# EAGLE design MCP3208BOB (EAGLE 9.6.2)
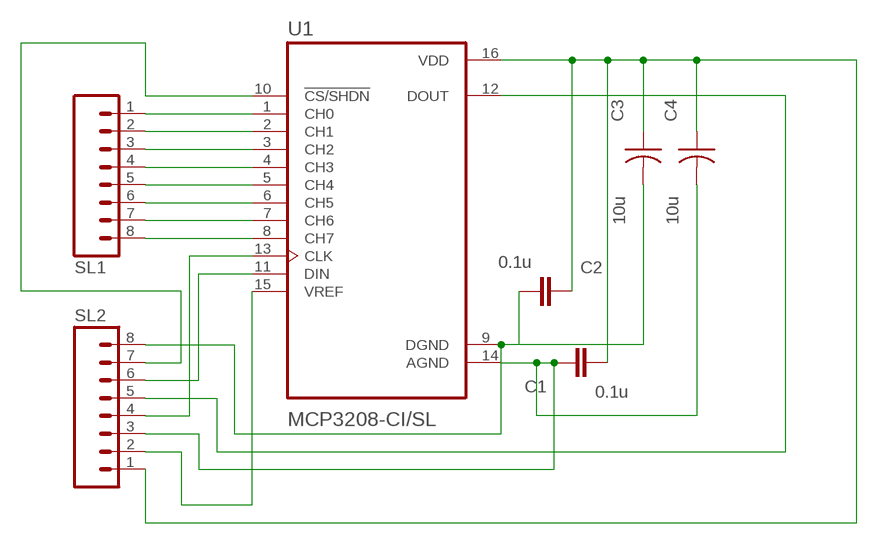
[diagram p0: schematic, sheet 1]

## Parts
C1  0.1u  CC0805KRX7R9BB104  [CAP_0805]
C2  0.1u  CC0805KRX7R9BB104  [CAP_0805]
C3  10u  TAJB106K016RNJ  [CAP_TANT_B]
C4  10u  TAJB106K016RNJ  [CAP_TANT_B]
SL1  M08  [08P]
SL2  M08  [08P]
U1  MCP3208-CI/SL  [SOIC127P600X175-16N]

## Nets
N$1: C1.2 C2.1 C3.1 C4.1 SL2.1 U1.16(VDD)
N$3: SL2.6 U1.11(DIN)
N$4: C1.1 C4.2 SL2.3 U1.14(AGND)
N$5: SL1.1 U1.1(CH0)
N$6: SL1.2 U1.2(CH1)
N$7: SL1.3 U1.3(CH2)
N$8: SL1.4 U1.4(CH3)
N$9: SL1.5 U1.5(CH4)
N$10: SL1.7 U1.7(CH6)
N$11: SL1.6 U1.6(CH5)
N$12: SL1.8 U1.8(CH7)
N$13: C2.2 C3.2 SL2.8 U1.9(DGND)
N$14: SL2.5 U1.12(DOUT)
N$15: SL2.7 U1.10(!CS/SHDN)
N$16: SL2.4 U1.13(CLK)
N$18: SL2.2 U1.15(VREF)

## Library data of the parts
C1 C2 = Resistor_Capacitor:CC0805KRX7R9BB104: CAP CER 0.1UF 50V X7R 0805 Manufacturer's datasheet <http://www.yageo.com/documents/recent/UPY-GPHC_X7R_6.3V-to-50V_18.pdf>; CREATED_BY: PCBLayout.com; DIGIKEY_PART_NUMBER: 311-1140-2-ND; MANUFACTURER: Yageo; MPN: CC0805KRX7R9BB104; PACKAGE: SMD 0805
C3 C4 = Resistor_Capacitor:TAJB106K016RNJ: CAP TANT 10UF 10% 16V 1411 Manufacturer's datasheet <http://datasheets.avx.com/TAJ.pdf>; CREATED_BY: PCBLayout.com; DIGIKEY_PART_NUMBER: 478-1673-2-ND; MANUFACTURER: AVX Corporation; MPN: TAJB106K016RNJ; PACKAGE: CAP TANT B
SL1 SL2 = con-amp-quick:M08: AMP QUICK CONNECTOR; OC_FARNELL: unknown; OC_NEWARK: unknown
U1 = MCP3208-CI_SL:MCP3208-CI/SL: Check availability <https://pricing.snapeda.com/parts/MCP3208-CI/SL/Microchip/view-part?ref=eda>; AVAILABILITY: In Stock; DESCRIPTION: 12 Bit Analog to Digital Converter 4, 8 Input 1 SAR 16-SOIC; MF: Microchip; MP: MCP3208-CI/SL; PACKAGE: SOIC-16 Microchip; PRICE: None; PURCHASE-URL: https://pricing.snapeda.com/search/part/MCP3208-CI/SL/?ref=eda

## Board
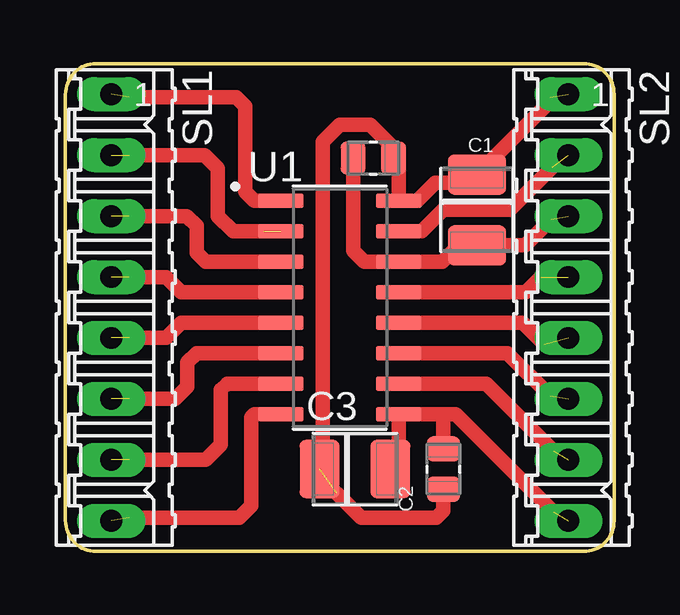
[diagram p1: board, top side]

Size 22.86 x 20.32 mm. Coordinates in mm from the lower left corner, seen from the top.
Outline: 0,19.05 arc-90 1.27,20.32 21.59,20.32 arc-90 22.86,19.05 22.86,1.27 arc-90 21.59,0 1.27,0 arc-90 0,1.27 0,19.05
Copper layers (1*16): Top 0.035mm / dielectric 1.5mm / Bottom 0.035mm
Design rules "default *": minimum track width 6mil, minimum drill 0.35mm, track to track 12mil, track to pad 12mil, pad to pad 12mil, via to via 12mil, smd to smd 12mil, copper to edge 40mil, drill to drill 6mil, minimum pad ring 10mil, minimum via ring 8mil, stop-mask expansion 4mil, vias tented up to drill 0mil, thermal gap 10mil

### Footprints (pad centres in the part's own frame; a part is rotated, then mirrored left to right if it is on the bottom)
CAP_0805 = smd 1.05 x 1.38: 1 -0.84,0; 2 0.84,0
CAP_TANT_B = smd 1.66 x 2.42: 1 -1.475,0; 2 1.475,0
08P = drill 0.914 long: 1 -8.89,0; 2 -6.35,0; 3 -3.81,0; 4 -1.27,0; 5 1.27,0; 6 3.81,0; 7 6.35,0; 8 8.89,0
SOIC127P600X175-16N = smd 1.9 x 0.6: 1 -2.455,4.445; 2 -2.455,3.175; 3 -2.455,1.905; 4 -2.455,0.635; 5 -2.455,-0.635; 6 -2.455,-1.905; 7 -2.455,-3.175; 8 -2.455,-4.445; 9 2.455,-4.445; 10 2.455,-3.175; 11 2.455,-1.905; 12 2.455,-0.635; 13 2.455,0.635; 14 2.455,1.905; 15 2.455,3.175; 16 2.455,4.445

### Placement (x,y rotation side)
C1  12.83,16.38 0 top
C2  15.75,3.43 90 top
C3  12.06,3.43 0 top
C4  17.14,14.22 270 top
SL1  1.9,10.16 270 top
SL2  20.95,10.16 270 top
U1  11.43,10.16 0 top

### Tracks (layer width: path | path; a pad name or v marks a point on that pad's centre or on a via)
N$1  (2 unrouted)
  Top 0.61: C2.1 15.75,1.7 15.45,1.4 12.32,1.4 11.3,2.41 | C3.1 10.72,3.56 10.72,17.08 11.43,17.78 12.7,17.78 13.67,16.81 C1.2 13.88,16.16 U1.16 14.65,14.6 15.41,15.37 16.3,15.37 16.64,15.7 C4.1 20.19,18.75 20.19,18.92
N$3  (1 unrouted)
  Top 0.61: 20.19,6.48 18.41,8.25 U1.11
N$4  (1 unrouted)
  Top 0.61: C4.2 16.38,12.75 15.7,12.06 U1.14 12.45,12.06 11.99,12.52 C1.1 | C4.2 19.15,12.75 20.24,13.84 | C4.2 17.27,12.62
N$5  (1 unrouted)
  Top 0.61: U1.1 7.87,14.6 7.49,14.99 7.49,18.54 7.11,18.92 2.67,18.92
N$6  (2 unrouted)
  Top 0.61: 8.25,13.34 6.98,13.34 6.35,13.97 6.35,15.96 5.8,16.51 2.67,16.51
N$7  (1 unrouted)
  Top 0.61: U1.3 5.84,12.06 5.46,12.45 5.46,13.57 5.06,13.97 2.67,13.97
N$8  (1 unrouted)
  Top 0.61: U1.4 4.83,10.79 4.19,11.43 2.67,11.43
N$9  (1 unrouted)
  Top 0.61: U1.5 4.83,9.52 4.19,8.89 2.67,8.89
N$10  (1 unrouted)
  Top 0.61: U1.7 6.73,6.98 6.48,6.73 6.48,4.45 6.1,4.06 5.84,3.81 2.67,3.81
N$11  (1 unrouted)
  Top 0.61: U1.6 5.46,8.25 5.08,7.87 5.08,6.86 4.57,6.35 2.67,6.35
N$12  (1 unrouted)
  Top 0.61: U1.8 7.87,5.71 7.75,5.59 7.75,1.91 7.24,1.4 2.67,1.4
N$13  (1 unrouted)
  Top 0.61: U1.9 14.71,5.71 | U1.9 13.88,3.77 C3.2 | U1.9 15.75,5.71 C2.2 | U1.9 16.26,5.71 20.32,1.65
N$14  (1 unrouted)
  Top 0.61: U1.12 19.05,9.52 19.94,8.64
N$15  (1 unrouted)
  Top 0.61: 20.32,4.19 17.53,6.98 U1.10
N$16  (1 unrouted)
  Top 0.61: U1.13 19.18,10.79 19.81,11.43
N$18  (1 unrouted)
  Top 0.61: 14.35,13.34 U1.15 14.85,13.34 15.74,14.22 18.5,14.22 20.28,16